# EAGLE design GPSBreakoutBoard (EAGLE 7.6.0)
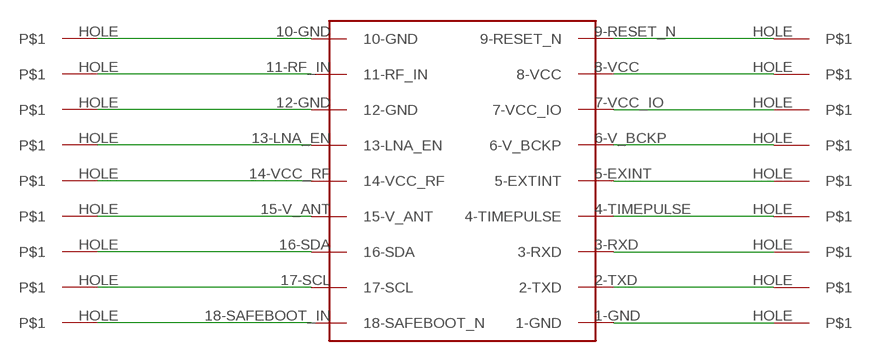
[diagram p0: schematic, sheet 1]

## Parts
U$1  GPS_DEVICE  [GPSMOUNT]
U$2  HOLE  [THING]
U$3  HOLE  [THING]
U$4  HOLE  [THING]
U$5  HOLE  [THING]
U$6  HOLE  [THING]
U$7  HOLE  [THING]
U$8  HOLE  [THING]
U$9  HOLE  [THING]
U$10  HOLE  [THING]
U$11  HOLE  [THING]
U$12  HOLE  [THING]
U$13  HOLE  [THING]
U$14  HOLE  [THING]
U$15  HOLE  [THING]
U$16  HOLE  [THING]
U$17  HOLE  [THING]
U$18  HOLE  [THING]
U$19  HOLE  [THING]

## Nets
N$1: U$1.10-GND U$2.HOLE
N$2: U$1.11-RF_IN U$3.HOLE
N$3: U$1.12-GND U$4.HOLE
N$4: U$1.13-LNA_EN U$5.HOLE
N$5: U$1.14-VCC_RF U$6.HOLE
N$6: U$1.15-V_ANT U$7.HOLE
N$7: U$1.16-SDA U$8.HOLE
N$8: U$1.17-SCL U$9.HOLE
N$9: U$1.18-SAFEBOOT_IN(18-SAFEBOOT_N) U$10.HOLE
N$10: U$1.9-RESET_N U$11.HOLE
N$11: U$1.8-VCC U$12.HOLE
N$12: U$1.7-VCC_IO U$13.HOLE
N$13: U$1.6-V_BCKP U$14.HOLE
N$14: U$1.5-EXINT(5-EXTINT) U$15.HOLE
N$15: U$1.4-TIMEPULSE U$16.HOLE
N$16: U$1.3-RXD U$17.HOLE
N$17: U$1.2-TXD U$18.HOLE
N$18: U$1.1-GND U$19.HOLE

## Library data of the parts
U$1 = GPSPackage:GPS_DEVICE
U$2-U$19 = GPSPackage:HOLE

## Board
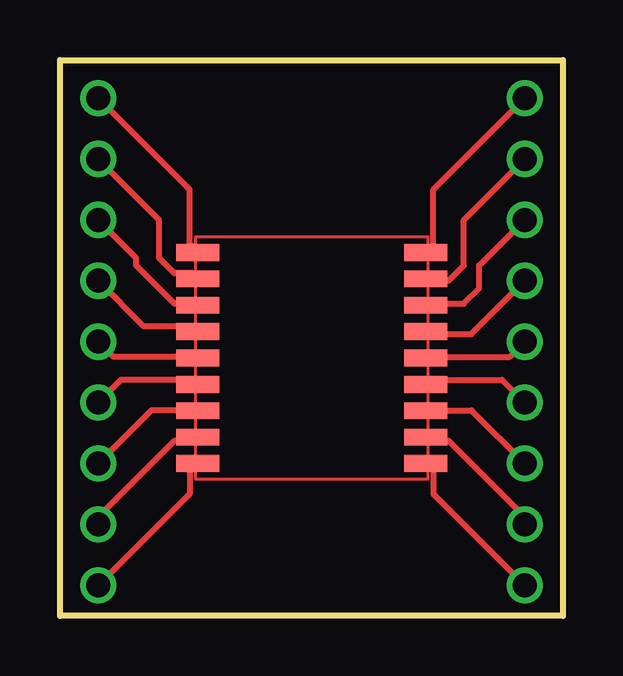
[diagram p1: board, top side]

Size 20.95 x 23.18 mm. Coordinates in mm from the lower left corner, seen from the top.
Outline: 0,0 0,23.18 20.95,23.18 20.95,0 0,0
Copper layers (1*16): Top 0.035mm / dielectric 1.5mm / Bottom 0.035mm
Design rules "default": minimum track width 10mil, minimum drill 24mil, track to track 8mil, track to pad 8mil, pad to pad 8mil, via to via 8mil, smd to smd 8mil, copper to edge 40mil, drill to drill 8mil, minimum pad ring 10mil, minimum via ring 8mil, stop-mask expansion 4mil, vias tented up to drill 0mil, thermal gap 10mil

### Footprints (pad centres in the part's own frame; a part is rotated, then mirrored left to right if it is on the bottom)
GPSMOUNT = smd 1.8 x 0.7: 1-GND 0,0; 2-TXD 0,1.1; 3-RXD 0,2.2; 4-TIMEPULSE 0,3.3; 5-EXINT 0,4.4; 6-V_BCKP 0,5.5; 7-VCC_IO 0,6.6; 8-VCC 0,7.7; 9-RESET_N 0,8.8; 10-GND -9.5,8.8; 11-RF_IN -9.5,7.7; 12-GND -9.5,6.6; 13-LNA_EN -9.5,5.5; 14-VCC_RF -9.5,4.4; 15-V_ANT -9.5,3.3; 16-SDA -9.5,2.2; 17-SCL -9.5,1.1; 18-SAFEBOOT_IN -9.5,0
THING = drill 1: HOLE 0,0

### Placement (x,y rotation side)
U$1  15.24,6.35 0 top
U$2  1.59,21.59 0 top
U$3  1.59,19.05 0 top
U$4  1.59,16.51 0 top
U$5  1.59,13.97 0 top
U$6  1.59,11.43 0 top
U$7  1.59,8.89 0 top
U$8  1.59,6.35 0 top
U$9  1.59,3.81 0 top
U$10  1.59,1.27 0 top
U$11  19.37,21.59 0 top
U$12  19.37,19.05 0 top
U$13  19.37,16.51 0 top
U$14  19.37,13.97 0 top
U$15  19.37,11.43 0 top
U$16  19.37,8.89 0 top
U$17  19.37,6.35 0 top
U$18  19.37,3.81 0 top
U$19  19.37,1.27 0 top

### Tracks (layer width: path | path; a pad name or v marks a point on that pad's centre or on a via)
N$1
  Top 0.254: U$1.10-GND 5.4,15.49 5.4,17.78 U$2.HOLE
N$2
  Top 0.254: U$1.11-RF_IN 5.5,14.29 4.76,14.29 4.13,14.92 4.13,16.51 U$3.HOLE
N$3
  Top 0.254: U$1.12-GND 5.67,13.02 4.76,13.02 3.18,14.61 3.18,14.92 U$4.HOLE
N$4
  Top 0.254: U$1.13-LNA_EN 5.53,12.07 3.49,12.07 U$5.HOLE
N$5
  Top 0.254: U$1.14-VCC_RF 5.69,10.79 2.22,10.79 U$6.HOLE
N$6
  Top 0.254: U$1.15-V_ANT 5.55,9.84 2.54,9.84 U$7.HOLE
N$7
  Top 0.254: U$1.16-SDA 5.72,8.57 3.81,8.57 U$8.HOLE
N$8
  Top 0.254: U$1.17-SCL 5.59,7.3 4.76,7.3 1.59,4.13 U$9.HOLE
N$9
  Top 0.254: U$1.18-SAFEBOOT_IN 5.4,6.01 5.4,5.08 U$10.HOLE
N$10
  Top 0.254: U$1.9-RESET_N 15.56,15.47 15.56,17.78 U$11.HOLE
N$11
  Top 0.254: U$1.8-VCC 15.32,13.97 16.19,13.97 16.83,14.61 16.83,16.51 U$12.HOLE
N$12
  Top 0.254: U$1.7-VCC_IO 15.31,13.02 16.83,13.02 17.46,13.65 17.46,14.61 U$13.HOLE
N$13
  Top 0.254: U$1.6-V_BCKP 15.34,11.75 17.15,11.75 U$14.HOLE
N$14
  Top 0.254: U$1.5-EXINT 15.29,10.79 18.73,10.79 U$15.HOLE
N$15
  Top 0.254: U$1.4-TIMEPULSE 15.43,9.84 18.41,9.84 U$16.HOLE
N$16
  Top 0.254: U$1.3-RXD 15.26,8.57 17.15,8.57 U$17.HOLE
N$17
  Top 0.254: U$1.2-TXD 15.39,7.3 16.19,7.3 19.37,4.13 U$18.HOLE
N$18
  Top 0.254: U$1.1-GND 15.56,6.03 15.56,5.08 U$19.HOLE